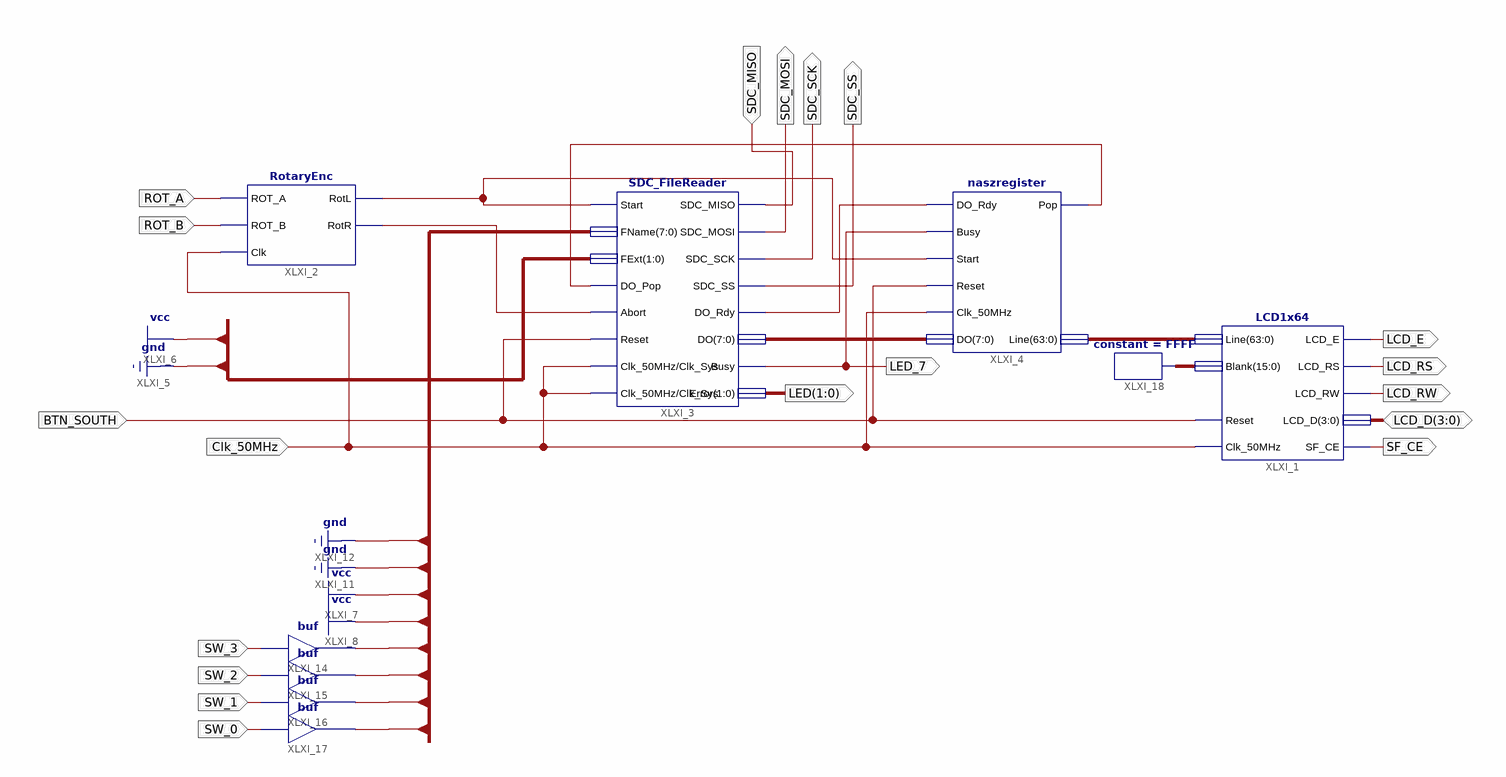
[diagram p0: schematic sheet 1]
// Xilinx ISE schematic baseSchema.sch (xc9500xl) as structural Verilog: 9 symbols, 19 ports
module baseSchema (
  input  Clk_50MHz,
  input  BTN_SOUTH,
  input  SDC_MISO,
  input  SW_3,
  input  SW_2,
  input  SW_1,
  input  SW_0,
  input  ROT_A,
  input  ROT_B,
  inout  [3:0] LCD_D,
  output LED_7,
  output [1:0] LED,
  output SDC_MOSI,
  output SDC_SS,
  output SDC_SCK,
  output LCD_E,
  output LCD_RS,
  output LCD_RW,
  output SF_CE
);

  wire XLXN_4, XLXN_9, XLXN_13, XLXN_15;
  wire [3:0] FName;
  wire [7:0] XLXN_2;
  wire [15:0] XLXN_55;
  wire [63:0] XLXN_1;

  LCD1x64 XLXI_1 (
    .Clk_50MHz(Clk_50MHz), .Reset(BTN_SOUTH), .Line(XLXN_1), .Blank(XLXN_55), .LCD_D(LCD_D), .LCD_E(LCD_E),
    .LCD_RW(LCD_RW), .LCD_RS(LCD_RS), .SF_CE(SF_CE));
  RotaryEnc XLXI_2 (.ROT_A(ROT_A), .ROT_B(ROT_B), .RotL(XLXN_15), .RotR(XLXN_13), .Clk(Clk_50MHz));
  SDC_FileReader XLXI_3 (
    .SDC_MISO(SDC_MISO), .Start(XLXN_15), .FName({4'b0011, FName}), .Reset(BTN_SOUTH), .Clk_50MHz(Clk_50MHz),
    .DO_Pop(XLXN_9), .Abort(XLXN_13), .SDC_MOSI(SDC_MOSI), .SDC_SCK(SDC_SCK), .SDC_SS(SDC_SS), .Error(LED),
    .DO(XLXN_2), .DO_Rdy(XLXN_4), .Busy(LED_7), .FExt(2'b10), .Clk_Sys(Clk_50MHz));
  naszregister XLXI_4 (
    .DO_Rdy(XLXN_4), .Busy(LED_7), .Start(XLXN_15), .Reset(BTN_SOUTH), .Clk_50MHz(Clk_50MHz), .DO(XLXN_2),
    .Pop(XLXN_9), .Line(XLXN_1));
  buf XLXI_14 (FName[3], SW_3);
  buf XLXI_15 (FName[2], SW_2);
  buf XLXI_16 (FName[1], SW_1);
  buf XLXI_17 (FName[0], SW_0);
  constant #(.CValue("FFFF")) XLXI_18 (.O(XLXN_55));
endmodule
